# Altium schematic sheet 48V_Converter_Sub.SchDoc
size A
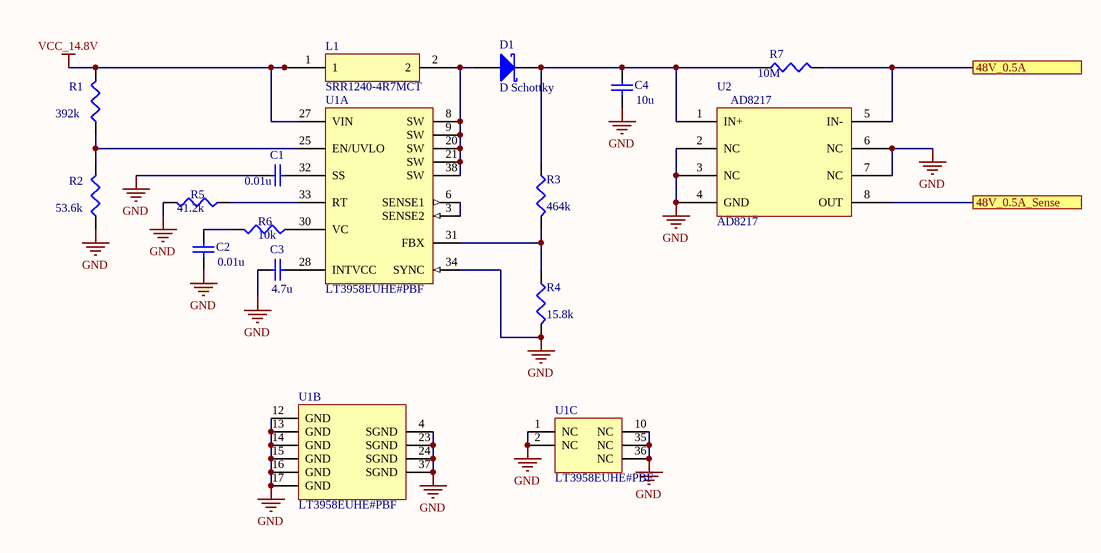
[diagram p0: 48V_Converter_Sub.SchDoc]

## Parts
C1  value 0.01u  [C1206]  (hidden comment: Cap Semi)
C2  value 0.01u  [C1206]  (hidden comment: Cap Semi)
C3  value 4.7u  [C1206]  (hidden comment: Cap Semi)
C4  value 10u  [C1206]  (hidden comment: Cap Semi)
D1  D Schottky  [SMB]
L1  SRR1240-4R7MCT  [SRR1240-4R7M]
R1  value 392k  [J1-0603]  (hidden comment: Res3)
R2  value 53.6k  [J1-0603]  (hidden comment: Res3)
R3  value 464k  [J1-0603]  (hidden comment: Res3)
R4  value 15.8k  [J1-0603]  (hidden comment: Res3)
R5  value 41.2k  [J1-0603]  (hidden comment: Res3)
R6  value 10k  [J1-0603]  (hidden comment: Res3)
R7  value 10M  [J1-0603]  (hidden comment: Res3)
U1  LT3958EUHE#PBF  [LT-UHE-36-V-UHE28MA_V]  (parts A,B,C of 3)
U2  AD8217  [AD8217]

## Ports
48V_0.5A, 48V_0.5A_Sense

## Nets
GND: C1.2 C2.2 C3.2 C4.2 R2.1 R4.2 R5.2 U1.1(NC) U1.2(NC) U1.4(SGND) U1.10(NC) U1.12(GND) U1.13(GND) U1.14(GND) U1.15(GND) U1.16(GND) U1.17(GND) U1.23(SGND) U1.24(SGND) U1.34(SYNC) U1.35(NC) U1.36(NC) U1.37(SGND) U2.2(NC) U2.3(NC) U2.4(GND) U2.6(NC) U2.7(NC)
VCC_14.8V: L1.1 R1.2 U1.27(VIN)
48V_0.5A: R7.2 U2.5(IN-) ; port 48V_0.5A
48V_0.5A_Sense: U2.8(OUT) ; port 48V_0.5A_Sense
NetC1_1: C1.1 U1.32(SS)
NetC2_1: C2.1 R6.2
NetC3_1: C3.1 U1.28(INTVCC)
NetC4_1: C4.1 D1.2(K) R3.1 R7.1 U2.1(IN+)
NetD1_1: D1.1(A) L1.2 U1.8(SW) U1.9(SW) U1.20(SW) U1.21(SW) U1.38(SW)
NetR1_1: R1.1 R2.2 U1.25(EN/UVLO)
NetR3_2: R3.2 R4.1 U1.31(FBX)
NetR5_1: R5.1 U1.33(RT)
NetR6_1: R6.1 U1.30(VC)
NetU1_3: U1.3(SENSE2) U1.6(SENSE1)

## Library data of the parts
C1-C4 = Cap Semi: Capacitor (Semiconductor SIM Model); Published: 8-Jun-2000; LatestRevisionDate: 29-May-2009; LatestRevisionNote: IPC-7351 Footprint Added.; PackageReference: C1206; Publisher: Altium Limited; PackageDescription: Chip Capacitor
D1 = D Schottky: Schottky Diode; Published: 8-Jun-2000; LatestRevisionDate: 17-Jul-2002; LatestRevisionNote: Re-released for DXP Platform.; PackageReference: SMB; Publisher: Altium Limited; PackageDescription: DO-214-AA/SMB; 2 C-Bend Leads; Body 5.3 x 3.6 mm, inc. leads (LxW); Code_JEDEC: DO-214-AA
R1-R7 = Res3: Resistor; Published: 8-Jun-2000; LatestRevisionDate: 29-May-2009; LatestRevisionNote: IPC-7351 Footprint Added.; PackageReference: J1-0603; Publisher: Altium Limited; PackageDescription: Chip Resistor
U1 = LT3958EUHE#PBF: High Input Voltage, Boost, Flyback, SEPIC and Inverting Converter, 36-pin QFN (UHE-36-UHE28MA), -40 to 125 degC, Pb-Free; Manufacturer: Linear Technology; Frequency Adjust Range: 100kHz - 1MHz; Number of Outputs: 1; PackageVersion: Rev. D, 02/2012; PackageReference: UHE-36; PackageDescription: 28-Pin Plastic QFN, Body 5 x 6 mm, Pitch 0.5 mm; Supplier 1: Digi-Key; Supplier Part Number 1: LT3958EUHE#PBF-ND; Supplier 2: Farnell; Supplier Part Number 2: 2294964; Supplier 3: Newark; Supplier Part Number 3: 78R8466; RoHS: TRUE; Mounting Technology: Surface Mount; PartNumber: LT3958EUHE#PBF; ComponentLink1Description: Manufacturer URL; ComponentLink1URL: http://www.linear.com/; ComponentLink2Description: Datasheet; ComponentLink2URL: http://cds.linear.com/docs/en/datasheet/3958f.pdf; ComponentLink3Description: Package Specification; ComponentLink3URL: http://cds.linear.com/docs/en/packaging/QFN_28_05-08-1836.pdf
U2 = AD8217: Current Sense; ComponentLink1Description: Datasheet; ComponentLink1URL: http://www.analog.com/media/en/technical-documentation/data-sheets/AD8217.pdf